# Altium schematic sheet 038.SchDoc
size A; SheetNumber: 1; SheetTotal: 1
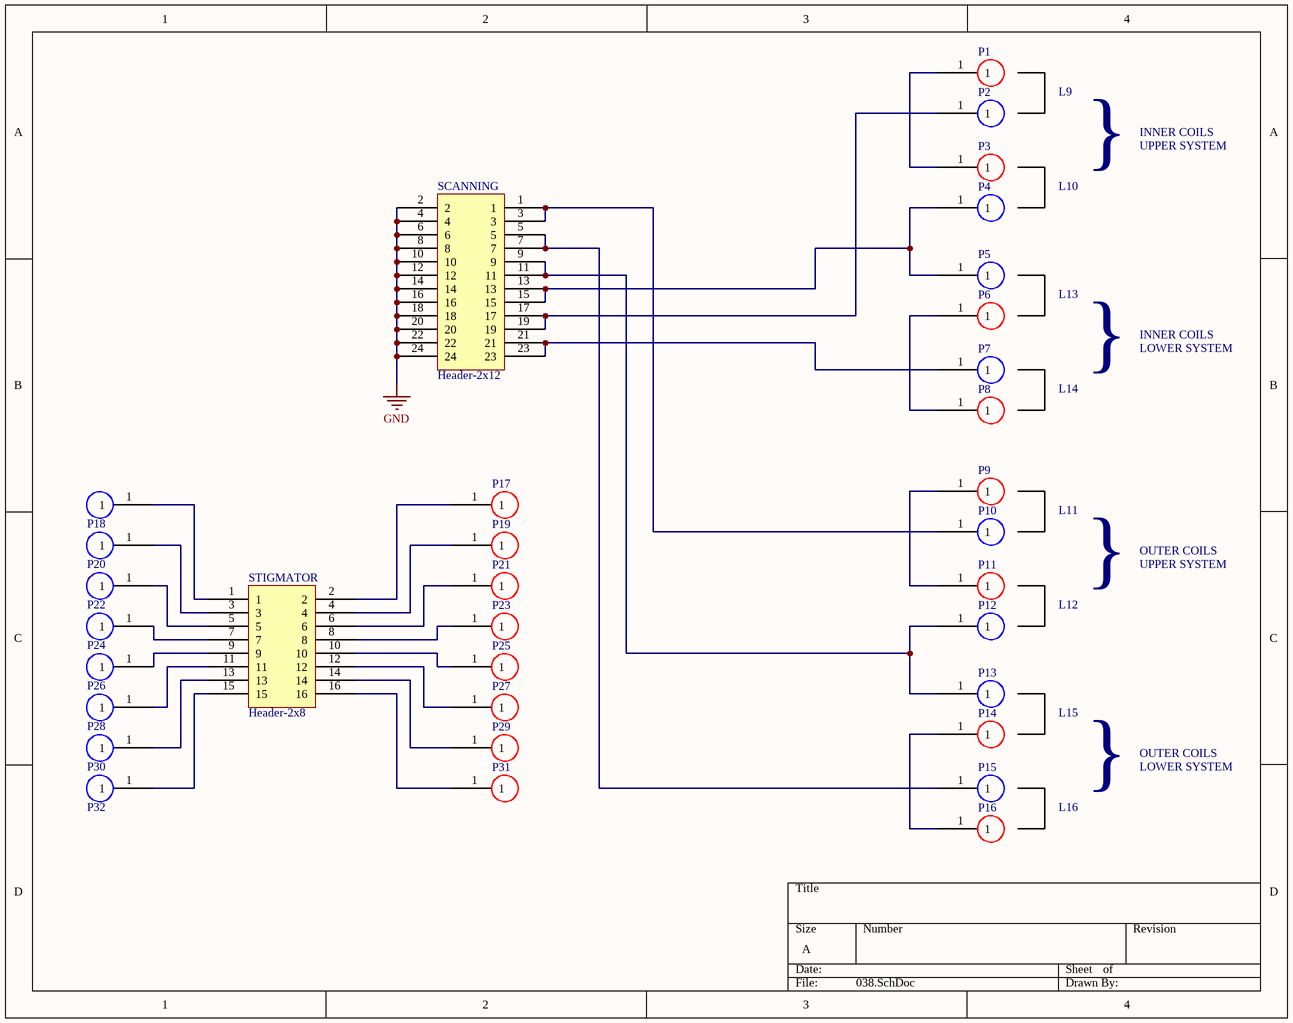
[diagram p0: 038.SchDoc]

## Parts
P1  PINM  [PINM]  (value not drawn)
P2  PIN  [PIN]  (value not drawn)
P3  PINM  [PINM]  (value not drawn)
P4  PIN  [PIN]  (value not drawn)
P5  PIN  [PIN]  (value not drawn)
P6  PINM  [PINM]  (value not drawn)
P7  PIN  [PIN]  (value not drawn)
P8  PINM  [PINM]  (value not drawn)
P9  PINM  [PINM]  (value not drawn)
P10  PIN  [PIN]  (value not drawn)
P11  PINM  [PINM]  (value not drawn)
P12  PIN  [PIN]  (value not drawn)
P13  PIN  [PIN]  (value not drawn)
P14  PINM  [PINM]  (value not drawn)
P15  PIN  [PIN]  (value not drawn)
P16  PINM  [PINM]  (value not drawn)
P17  PINM  [PINM]  (value not drawn)
P18  PIN  [PIN]  (value not drawn)
P19  PINM  [PINM]  (value not drawn)
P20  PIN  [PIN]  (value not drawn)
P21  PINM  [PINM]  (value not drawn)
P22  PIN  [PIN]  (value not drawn)
P23  PINM  [PINM]  (value not drawn)
P24  PIN  [PIN]  (value not drawn)
P25  PINM  [PINM]  (value not drawn)
P26  PIN  [PIN]  (value not drawn)
P27  PINM  [PINM]  (value not drawn)
P28  PIN  [PIN]  (value not drawn)
P29  PINM  [PINM]  (value not drawn)
P30  PIN  [PIN]  (value not drawn)
P31  PINM  [PINM]  (value not drawn)
P32  PIN  [PIN]  (value not drawn)
SCANNING  Header-2x12  [scanning]
STIGMATOR  Header-2x8  [STIGMATOR]

## Nets
GND: SCANNING.2 SCANNING.4 SCANNING.6 SCANNING.8 SCANNING.10 SCANNING.12 SCANNING.14 SCANNING.16 SCANNING.18 SCANNING.20 SCANNING.22 SCANNING.24
NetP1_1: P1.1 P3.1
NetP2_1: P2.1 SCANNING.17 SCANNING.19
NetP4_1: P4.1 P5.1 SCANNING.13 SCANNING.15
NetP6_1: P6.1 P8.1
NetP7_1: P7.1 SCANNING.21 SCANNING.23
NetP9_1: P9.1 P11.1
NetP10_1: P10.1 SCANNING.1 SCANNING.3
NetP12_1: P12.1 P13.1 SCANNING.9 SCANNING.11
NetP14_1: P14.1 P16.1
NetP15_1: P15.1 SCANNING.5 SCANNING.7
NetP17_1: P17.1 STIGMATOR.2
NetP18_1: P18.1 STIGMATOR.1
NetP19_1: P19.1 STIGMATOR.4
NetP20_1: P20.1 STIGMATOR.3
NetP21_1: P21.1 STIGMATOR.6
NetP22_1: P22.1 STIGMATOR.5
NetP23_1: P23.1 STIGMATOR.8
NetP24_1: P24.1 STIGMATOR.7
NetP25_1: P25.1 STIGMATOR.10
NetP26_1: P26.1 STIGMATOR.9
NetP27_1: P27.1 STIGMATOR.12
NetP28_1: P28.1 STIGMATOR.11
NetP29_1: P29.1 STIGMATOR.14
NetP30_1: P30.1 STIGMATOR.13
NetP31_1: P31.1 STIGMATOR.16
NetP32_1: P32.1 STIGMATOR.15

## Notes on the sheet
- L9
- INNER COILS
- UPPER SYSTEM
- L10
- }
- L13
- LOWER SYSTEM
- L14
- L11
- OUTER COILS
- L12
- L15
- L16